# EasyEDA schematic Sheet_1.json
TITLE: Sheet_1; REV: 1.0; Date: 2023-08-03; Sheet: 1/1; Drawn By: calico-cat-3333; Company: Your Company
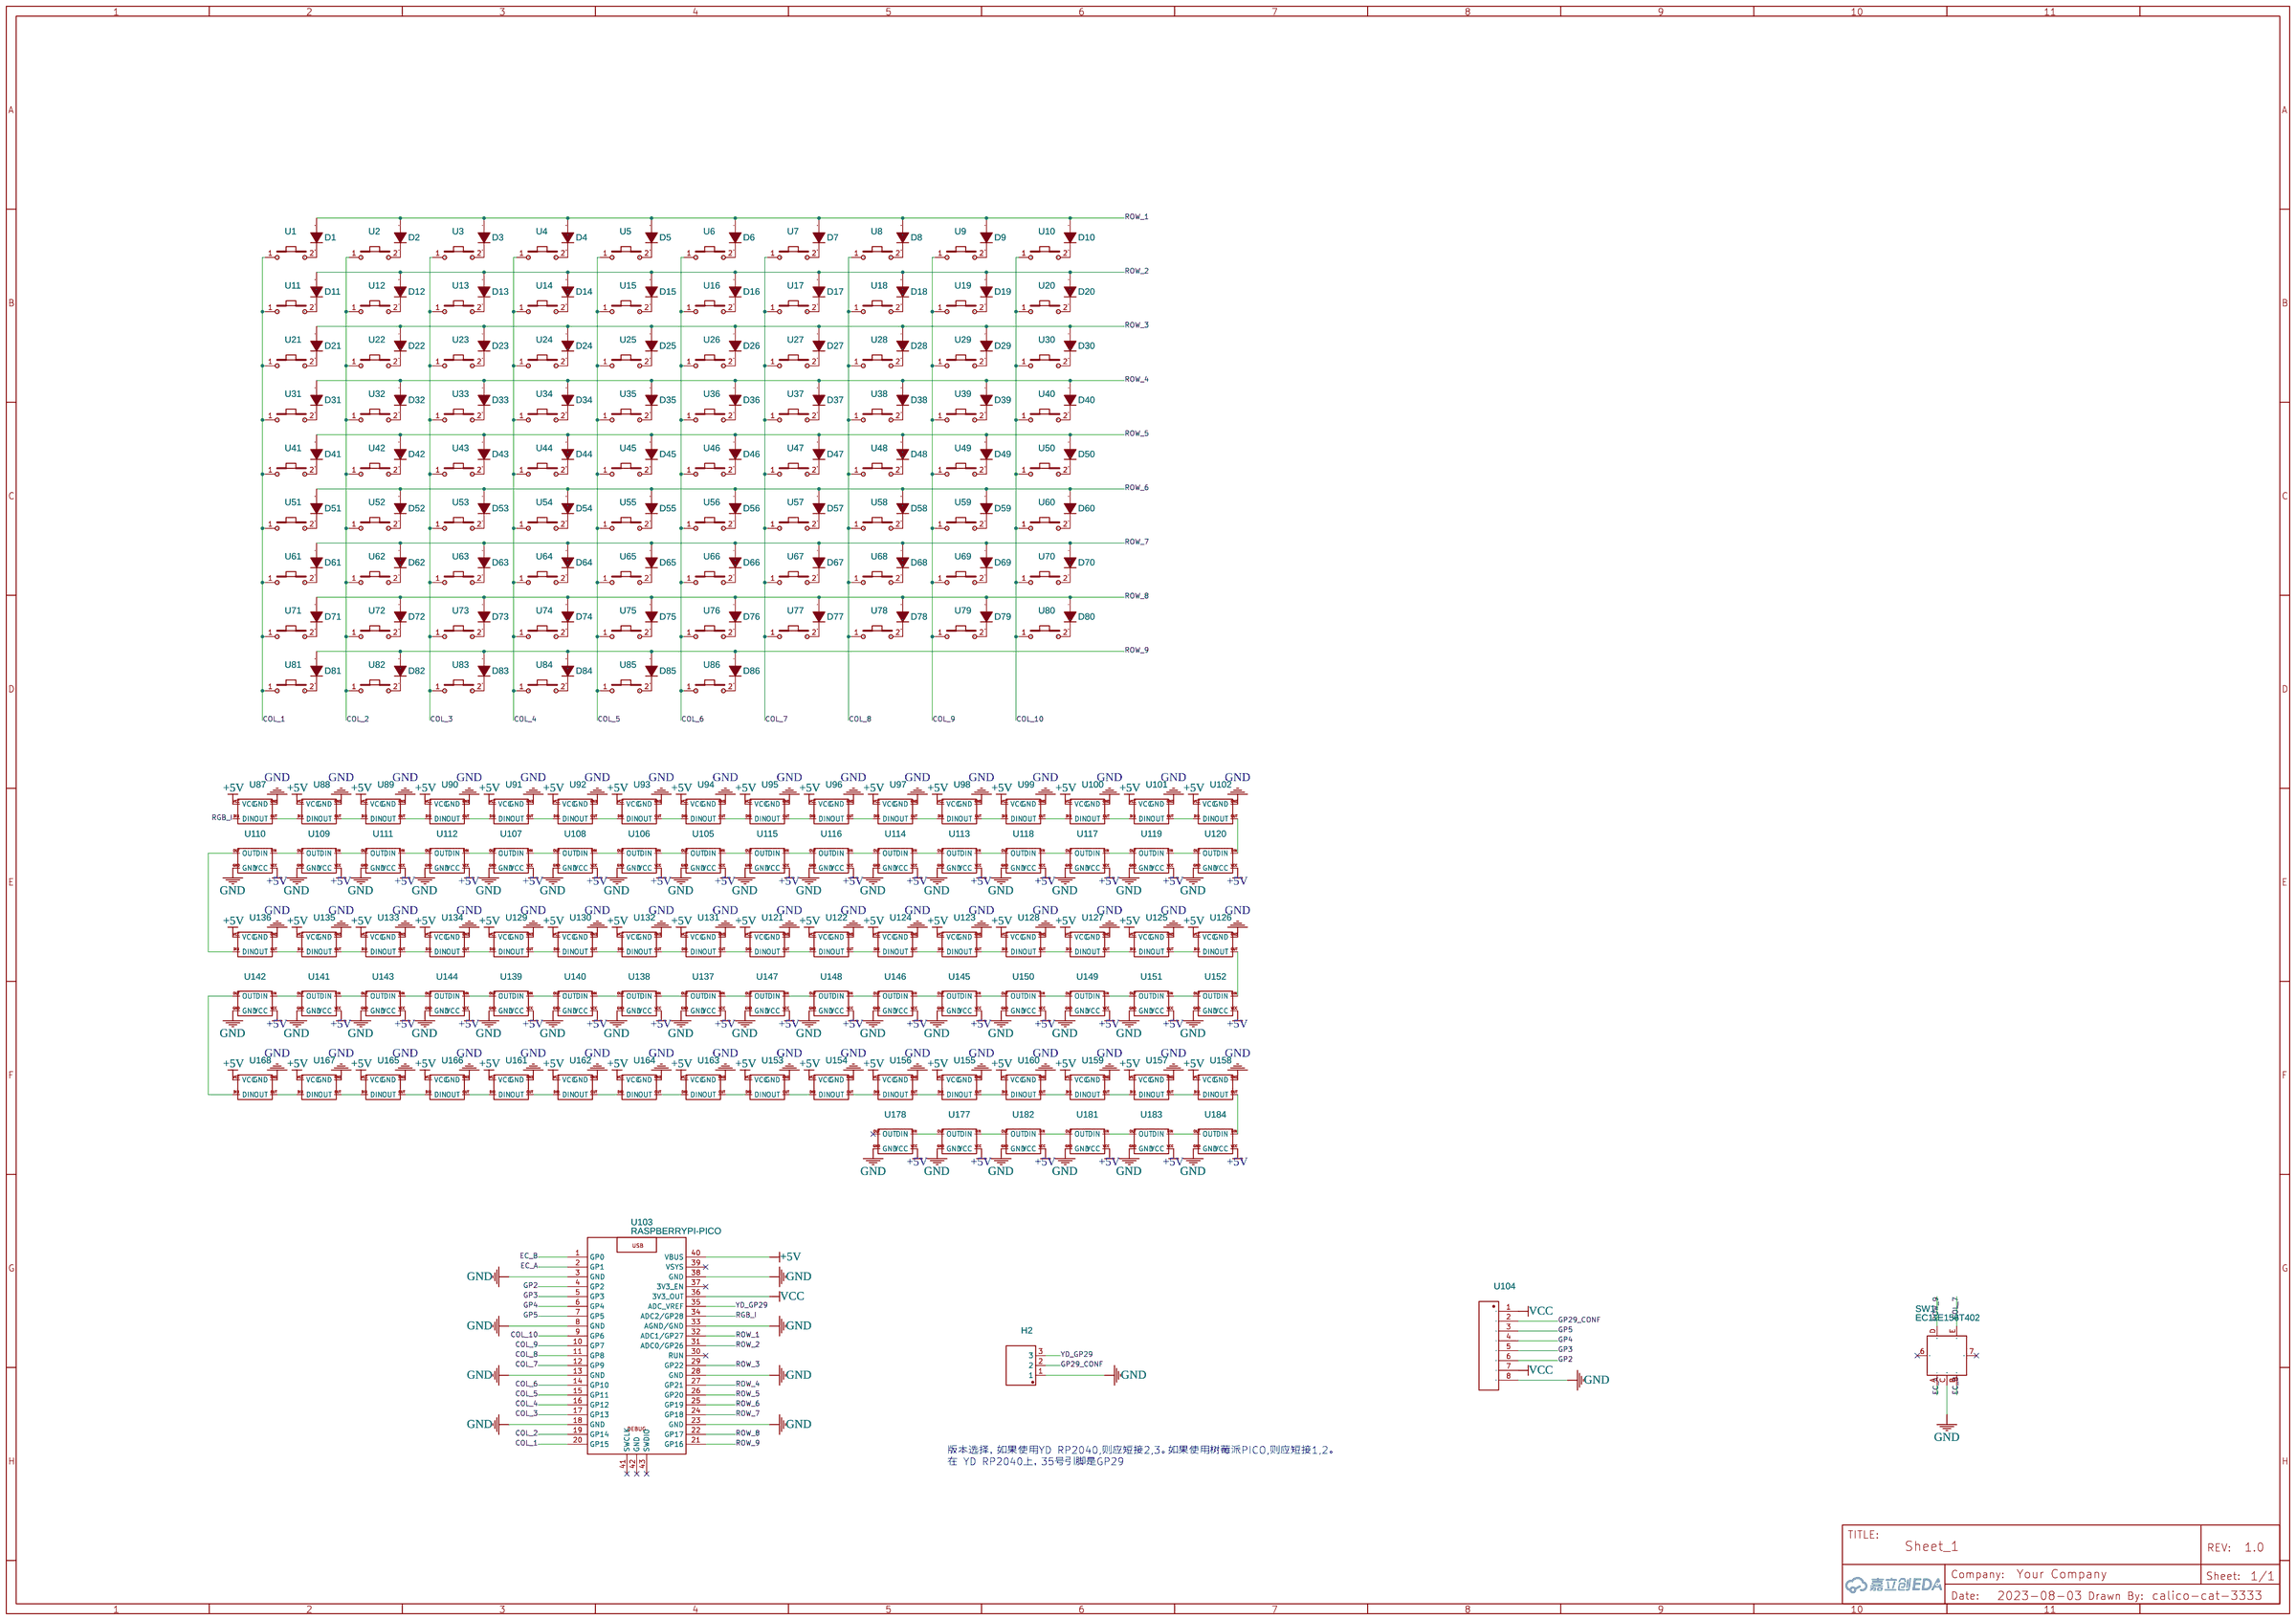
[diagram p0: schematic sheet]

## Parts
D1  TC1N4148T26B  [DO-35_BD2.0-L4.2-P8.20-D0.5-R-RD]
D2  TC1N4148T26B  [DO-35_BD2.0-L4.2-P8.20-D0.5-R-RD]
D3  TC1N4148T26B  [DO-35_BD2.0-L4.2-P8.20-D0.5-R-RD]
D4  TC1N4148T26B  [DO-35_BD2.0-L4.2-P8.20-D0.5-R-RD]
D5  TC1N4148T26B  [DO-35_BD2.0-L4.2-P8.20-D0.5-R-RD]
D6  TC1N4148T26B  [DO-35_BD2.0-L4.2-P8.20-D0.5-R-RD]
D7  TC1N4148T26B  [DO-35_BD2.0-L4.2-P8.20-D0.5-R-RD]
D8  TC1N4148T26B  [DO-35_BD2.0-L4.2-P8.20-D0.5-R-RD]
D9  TC1N4148T26B  [DO-35_BD2.0-L4.2-P8.20-D0.5-R-RD]
D10  TC1N4148T26B  [DO-35_BD2.0-L4.2-P8.20-D0.5-R-RD]
D11  TC1N4148T26B  [DO-35_BD2.0-L4.2-P8.20-D0.5-R-RD]
D12  TC1N4148T26B  [DO-35_BD2.0-L4.2-P8.20-D0.5-R-RD]
D13  TC1N4148T26B  [DO-35_BD2.0-L4.2-P8.20-D0.5-R-RD]
D14  TC1N4148T26B  [DO-35_BD2.0-L4.2-P8.20-D0.5-R-RD]
D15  TC1N4148T26B  [DO-35_BD2.0-L4.2-P8.20-D0.5-R-RD]
D16  TC1N4148T26B  [DO-35_BD2.0-L4.2-P8.20-D0.5-R-RD]
D17  TC1N4148T26B  [DO-35_BD2.0-L4.2-P8.20-D0.5-R-RD]
D18  TC1N4148T26B  [DO-35_BD2.0-L4.2-P8.20-D0.5-R-RD]
D19  TC1N4148T26B  [DO-35_BD2.0-L4.2-P8.20-D0.5-R-RD]
D20  TC1N4148T26B  [DO-35_BD2.0-L4.2-P8.20-D0.5-R-RD]
D21  TC1N4148T26B  [DO-35_BD2.0-L4.2-P8.20-D0.5-R-RD]
D22  TC1N4148T26B  [DO-35_BD2.0-L4.2-P8.20-D0.5-R-RD]
D23  TC1N4148T26B  [DO-35_BD2.0-L4.2-P8.20-D0.5-R-RD]
D24  TC1N4148T26B  [DO-35_BD2.0-L4.2-P8.20-D0.5-R-RD]
D25  TC1N4148T26B  [DO-35_BD2.0-L4.2-P8.20-D0.5-R-RD]
D26  TC1N4148T26B  [DO-35_BD2.0-L4.2-P8.20-D0.5-R-RD]
D27  TC1N4148T26B  [DO-35_BD2.0-L4.2-P8.20-D0.5-R-RD]
D28  TC1N4148T26B  [DO-35_BD2.0-L4.2-P8.20-D0.5-R-RD]
D29  TC1N4148T26B  [DO-35_BD2.0-L4.2-P8.20-D0.5-R-RD]
D30  TC1N4148T26B  [DO-35_BD2.0-L4.2-P8.20-D0.5-R-RD]
D31  TC1N4148T26B  [DO-35_BD2.0-L4.2-P8.20-D0.5-R-RD]
D32  TC1N4148T26B  [DO-35_BD2.0-L4.2-P8.20-D0.5-R-RD]
D33  TC1N4148T26B  [DO-35_BD2.0-L4.2-P8.20-D0.5-R-RD]
D34  TC1N4148T26B  [DO-35_BD2.0-L4.2-P8.20-D0.5-R-RD]
D35  TC1N4148T26B  [DO-35_BD2.0-L4.2-P8.20-D0.5-R-RD]
D36  TC1N4148T26B  [DO-35_BD2.0-L4.2-P8.20-D0.5-R-RD]
D37  TC1N4148T26B  [DO-35_BD2.0-L4.2-P8.20-D0.5-R-RD]
D38  TC1N4148T26B  [DO-35_BD2.0-L4.2-P8.20-D0.5-R-RD]
D39  TC1N4148T26B  [DO-35_BD2.0-L4.2-P8.20-D0.5-R-RD]
D40  TC1N4148T26B  [DO-35_BD2.0-L4.2-P8.20-D0.5-R-RD]
D41  TC1N4148T26B  [DO-35_BD2.0-L4.2-P8.20-D0.5-R-RD]
D42  TC1N4148T26B  [DO-35_BD2.0-L4.2-P8.20-D0.5-R-RD]
D43  TC1N4148T26B  [DO-35_BD2.0-L4.2-P8.20-D0.5-R-RD]
D44  TC1N4148T26B  [DO-35_BD2.0-L4.2-P8.20-D0.5-R-RD]
D45  TC1N4148T26B  [DO-35_BD2.0-L4.2-P8.20-D0.5-R-RD]
D46  TC1N4148T26B  [DO-35_BD2.0-L4.2-P8.20-D0.5-R-RD]
D47  TC1N4148T26B  [DO-35_BD2.0-L4.2-P8.20-D0.5-R-RD]
D48  TC1N4148T26B  [DO-35_BD2.0-L4.2-P8.20-D0.5-R-RD]
D49  TC1N4148T26B  [DO-35_BD2.0-L4.2-P8.20-D0.5-R-RD]
D50  TC1N4148T26B  [DO-35_BD2.0-L4.2-P8.20-D0.5-R-RD]
D51  TC1N4148T26B  [DO-35_BD2.0-L4.2-P8.20-D0.5-R-RD]
D52  TC1N4148T26B  [DO-35_BD2.0-L4.2-P8.20-D0.5-R-RD]
D53  TC1N4148T26B  [DO-35_BD2.0-L4.2-P8.20-D0.5-R-RD]
D54  TC1N4148T26B  [DO-35_BD2.0-L4.2-P8.20-D0.5-R-RD]
D55  TC1N4148T26B  [DO-35_BD2.0-L4.2-P8.20-D0.5-R-RD]
D56  TC1N4148T26B  [DO-35_BD2.0-L4.2-P8.20-D0.5-R-RD]
D57  TC1N4148T26B  [DO-35_BD2.0-L4.2-P8.20-D0.5-R-RD]
D58  TC1N4148T26B  [DO-35_BD2.0-L4.2-P8.20-D0.5-R-RD]
D59  TC1N4148T26B  [DO-35_BD2.0-L4.2-P8.20-D0.5-R-RD]
D60  TC1N4148T26B  [DO-35_BD2.0-L4.2-P8.20-D0.5-R-RD]
D61  TC1N4148T26B  [DO-35_BD2.0-L4.2-P8.20-D0.5-R-RD]
D62  TC1N4148T26B  [DO-35_BD2.0-L4.2-P8.20-D0.5-R-RD]
D63  TC1N4148T26B  [DO-35_BD2.0-L4.2-P8.20-D0.5-R-RD]
D64  TC1N4148T26B  [DO-35_BD2.0-L4.2-P8.20-D0.5-R-RD]
D65  TC1N4148T26B  [DO-35_BD2.0-L4.2-P8.20-D0.5-R-RD]
D66  TC1N4148T26B  [DO-35_BD2.0-L4.2-P8.20-D0.5-R-RD]
D67  TC1N4148T26B  [DO-35_BD2.0-L4.2-P8.20-D0.5-R-RD]
D68  TC1N4148T26B  [DO-35_BD2.0-L4.2-P8.20-D0.5-R-RD]
D69  TC1N4148T26B  [DO-35_BD2.0-L4.2-P8.20-D0.5-R-RD]
D70  TC1N4148T26B  [DO-35_BD2.0-L4.2-P8.20-D0.5-R-RD]
D71  TC1N4148T26B  [DO-35_BD2.0-L4.2-P8.20-D0.5-R-RD]
D72  TC1N4148T26B  [DO-35_BD2.0-L4.2-P8.20-D0.5-R-RD]
D73  TC1N4148T26B  [DO-35_BD2.0-L4.2-P8.20-D0.5-R-RD]
D74  TC1N4148T26B  [DO-35_BD2.0-L4.2-P8.20-D0.5-R-RD]
D75  TC1N4148T26B  [DO-35_BD2.0-L4.2-P8.20-D0.5-R-RD]
D76  TC1N4148T26B  [DO-35_BD2.0-L4.2-P8.20-D0.5-R-RD]
D77  TC1N4148T26B  [DO-35_BD2.0-L4.2-P8.20-D0.5-R-RD]
D78  TC1N4148T26B  [DO-35_BD2.0-L4.2-P8.20-D0.5-R-RD]
D79  TC1N4148T26B  [DO-35_BD2.0-L4.2-P8.20-D0.5-R-RD]
D80  TC1N4148T26B  [DO-35_BD2.0-L4.2-P8.20-D0.5-R-RD]
D81  TC1N4148T26B  [DO-35_BD2.0-L4.2-P8.20-D0.5-R-RD]
D82  TC1N4148T26B  [DO-35_BD2.0-L4.2-P8.20-D0.5-R-RD]
D83  TC1N4148T26B  [DO-35_BD2.0-L4.2-P8.20-D0.5-R-RD]
D84  TC1N4148T26B  [DO-35_BD2.0-L4.2-P8.20-D0.5-R-RD]
D85  TC1N4148T26B  [DO-35_BD2.0-L4.2-P8.20-D0.5-R-RD]
D86  TC1N4148T26B  [DO-35_BD2.0-L4.2-P8.20-D0.5-R-RD]
H2  210S-1*3P L=11.6MMGold-plated black  [HDR-TH_3P-P2.54-V-M-1]
SW1  EC11E156T402  [SW-TH_EC11E156T402]
U1  U90  [轴座]
U2  U90  [轴座]
U3  U90  [轴座]
U4  U90  [轴座]
U5  U90  [轴座]
U6  U90  [轴座]
U7  U90  [轴座]
U8  U90  [轴座]
U9  U90  [轴座]
U10  U90  [轴座]
U11  U90  [轴座]
U12  U90  [轴座]
U13  U90  [轴座]
U14  U90  [轴座]
U15  U90  [轴座]
U16  U90  [轴座]
U17  U90  [轴座]
U18  U90  [轴座]
U19  U90  [轴座]
U20  U90  [轴座]
U21  U90  [轴座]
U22  U90  [轴座]
U23  U90  [轴座]
U24  U90  [轴座]
U25  U90  [轴座]
U26  U90  [轴座]
U27  U90  [轴座]
U28  U90  [轴座]
U29  U90  [轴座]
U30  U90  [轴座]
U31  U90  [轴座]
U32  U90  [轴座]
U33  U90  [轴座]
U34  U90  [轴座]
U35  U90  [轴座]
U36  U90  [轴座]
U37  U90  [轴座]
U38  U90  [轴座]
U39  U90  [轴座]
U40  U90  [轴座]
U41  U90  [轴座]
U42  U90  [轴座]
U43  U90  [轴座]
U44  U90  [轴座]
U45  U90  [轴座]
U46  U90  [轴座]
U47  U90  [轴座]
U48  U90  [轴座]
U49  U90  [轴座]
U50  U90  [轴座]
U51  U90  [轴座]
U52  U90  [轴座]
U53  U90  [轴座]
U54  U90  [轴座]
U55  U90  [轴座]
U56  U90  [轴座]
U57  U90  [轴座]
U58  U90  [轴座]
U59  U90  [轴座]
U60  U90  [轴座]
U61  U90  [轴座]
U62  U90  [轴座]
U63  U90  [轴座]
U64  U90  [轴座]
U65  U90  [轴座]
U66  U90  [轴座]
U67  U90  [轴座]
U68  U90  [轴座]
U69  U90  [轴座]
U70  U90  [轴座]
U71  U90  [轴座]
U72  U90  [轴座]
U73  U90  [轴座]
U74  U90  [轴座]
U75  U90  [轴座]
U76  U90  [轴座]
U77  U90  [轴座]
U78  U90  [轴座]
U79  U90  [轴座]
U80  U90  [轴座]
U81  U90  [轴座]
U82  U90  [轴座]
U83  U90  [轴座]
U84  U90  [轴座]
U85  U90  [轴座]
U86  U90  [轴座]
U87  NO  [WS2812-3528-修正]
U88  NO  [WS2812-3528-修正]
U89  NO  [WS2812-3528-修正]
U90  NO  [WS2812-3528-修正]
U91  NO  [WS2812-3528-修正]
U92  NO  [WS2812-3528-修正]
U93  NO  [WS2812-3528-修正]
U94  NO  [WS2812-3528-修正]
U95  NO  [WS2812-3528-修正]
U96  NO  [WS2812-3528-修正]
U97  NO  [WS2812-3528-修正]
U98  NO  [WS2812-3528-修正]
U99  NO  [WS2812-3528-修正]
U100  NO  [WS2812-3528-修正]
U101  NO  [WS2812-3528-修正]
U102  NO  [WS2812-3528-修正]
U103  RASPBERRYPI-PICO  [RASPBERRYPI-PICO]
U104  U82  [排针 8P]
U105  NO  [WS2812-3528-修正]
U106  NO  [WS2812-3528-修正]
U107  NO  [WS2812-3528-修正]
U108  NO  [WS2812-3528-修正]
U109  NO  [WS2812-3528-修正]
U110  NO  [WS2812-3528-修正]
U111  NO  [WS2812-3528-修正]
U112  NO  [WS2812-3528-修正]
U113  NO  [WS2812-3528-修正]
U114  NO  [WS2812-3528-修正]
U115  NO  [WS2812-3528-修正]
U116  NO  [WS2812-3528-修正]
U117  NO  [WS2812-3528-修正]
U118  NO  [WS2812-3528-修正]
U119  NO  [WS2812-3528-修正]
U120  NO  [WS2812-3528-修正]
U121  NO  [WS2812-3528-修正]
U122  NO  [WS2812-3528-修正]
U123  NO  [WS2812-3528-修正]
U124  NO  [WS2812-3528-修正]
U125  NO  [WS2812-3528-修正]
U126  NO  [WS2812-3528-修正]
U127  NO  [WS2812-3528-修正]
U128  NO  [WS2812-3528-修正]
U129  NO  [WS2812-3528-修正]
U130  NO  [WS2812-3528-修正]
U131  NO  [WS2812-3528-修正]
U132  NO  [WS2812-3528-修正]
U133  NO  [WS2812-3528-修正]
U134  NO  [WS2812-3528-修正]
U135  NO  [WS2812-3528-修正]
U136  NO  [WS2812-3528-修正]
U137  NO  [WS2812-3528-修正]
U138  NO  [WS2812-3528-修正]
U139  NO  [WS2812-3528-修正]
U140  NO  [WS2812-3528-修正]
U141  NO  [WS2812-3528-修正]
U142  NO  [WS2812-3528-修正]
U143  NO  [WS2812-3528-修正]
U144  NO  [WS2812-3528-修正]
U145  NO  [WS2812-3528-修正]
U146  NO  [WS2812-3528-修正]
U147  NO  [WS2812-3528-修正]
U148  NO  [WS2812-3528-修正]
U149  NO  [WS2812-3528-修正]
U150  NO  [WS2812-3528-修正]
U151  NO  [WS2812-3528-修正]
U152  NO  [WS2812-3528-修正]
U153  NO  [WS2812-3528-修正]
U154  NO  [WS2812-3528-修正]
U155  NO  [WS2812-3528-修正]
U156  NO  [WS2812-3528-修正]
U157  NO  [WS2812-3528-修正]
U158  NO  [WS2812-3528-修正]
U159  NO  [WS2812-3528-修正]
U160  NO  [WS2812-3528-修正]
U161  NO  [WS2812-3528-修正]
U162  NO  [WS2812-3528-修正]
U163  NO  [WS2812-3528-修正]
U164  NO  [WS2812-3528-修正]
U165  NO  [WS2812-3528-修正]
U166  NO  [WS2812-3528-修正]
U167  NO  [WS2812-3528-修正]
U168  NO  [WS2812-3528-修正]
U177  NO  [WS2812-3528-修正]
U178  NO  [WS2812-3528-修正]
U181  NO  [WS2812-3528-修正]
U182  NO  [WS2812-3528-修正]
U183  NO  [WS2812-3528-修正]
U184  NO  [WS2812-3528-修正]

## Library data of the parts
D1-D86 = TC1N4148T26B: Contributor: LCSC; Supplier: LCSC; Supplier Part: C261224; Manufacturer: TC(德昌); JLCPCB Part Class: Extended Part; link: https://so.szlcsc.com/global.html?k=C261224&ref=editor
H2 = 210S-1*3P L=11.6MMGold-plated black: Contributor: LCSC; Supplier: LCSC; Manufacturer: Ckmtw(灿科盟); Manufacturer Part: B-2100S03P-A110; Supplier Part: C124376; JLCPCB Part Class: Extended Part; link: https://so.szlcsc.com/global.html?k=C124376&ref=editor
SW1 = EC11E156T402: Contributor: LCSC; Supplier: LCSC; Supplier Part: C2687292; Manufacturer: ALPSALPINE(阿尔卑斯阿尔派); JLCPCB Part Class: Extended Part; link: https://so.szlcsc.com/global.html?k=C2687292&ref=editor
U1-U86 = 轴座: Contributor: fengmoyiye
U87-U102 U105-U168 U177 U178 U181-U184 = WS2812-3528: Contributor: Jimssa
U103 = RASPBERRYPI-PICO: link: https://datasheets.raspberrypi.org/pico/pico-product-brief.pdf; Contributor: zhangwenyi
U104 = 排针 8P: Contributor: wxwt; Package Display: No

## Nets
+5V: U87.VCC U88.VCC U89.VCC U90.VCC U91.VCC U92.VCC U93.VCC U94.VCC U95.VCC U96.VCC U97.VCC U98.VCC U99.VCC U100.VCC U101.VCC U102.VCC U103.40(VBUS) U105.VCC U106.VCC U107.VCC U108.VCC U109.VCC U110.VCC U111.VCC U112.VCC U113.VCC U114.VCC U115.VCC U116.VCC U117.VCC U118.VCC U119.VCC U120.VCC U121.VCC U122.VCC U123.VCC U124.VCC U125.VCC U126.VCC U127.VCC U128.VCC U129.VCC U130.VCC U131.VCC U132.VCC U133.VCC U134.VCC U135.VCC U136.VCC U137.VCC U138.VCC U139.VCC U140.VCC U141.VCC U142.VCC U143.VCC U144.VCC U145.VCC U146.VCC U147.VCC U148.VCC U149.VCC U150.VCC U151.VCC U152.VCC U153.VCC U154.VCC U155.VCC U156.VCC U157.VCC U158.VCC U159.VCC U160.VCC U161.VCC U162.VCC U163.VCC U164.VCC U165.VCC U166.VCC U167.VCC U168.VCC U177.VCC U178.VCC U181.VCC U182.VCC U183.VCC U184.VCC
GND: H2.1 SW1.C U87.GND U88.GND U89.GND U90.GND U91.GND U92.GND U93.GND U94.GND U95.GND U96.GND U97.GND U98.GND U99.GND U100.GND U101.GND U102.GND U103.3(GND) U103.8(GND) U103.13(GND) U103.18(GND) U103.23(GND) U103.28(GND) U103.33(AGND/GND) U103.38(GND) U104.8 U105.GND U106.GND U107.GND U108.GND U109.GND U110.GND U111.GND U112.GND U113.GND U114.GND U115.GND U116.GND U117.GND U118.GND U119.GND U120.GND U121.GND U122.GND U123.GND U124.GND U125.GND U126.GND U127.GND U128.GND U129.GND U130.GND U131.GND U132.GND U133.GND U134.GND U135.GND U136.GND U137.GND U138.GND U139.GND U140.GND U141.GND U142.GND U143.GND U144.GND U145.GND U146.GND U147.GND U148.GND U149.GND U150.GND U151.GND U152.GND U153.GND U154.GND U155.GND U156.GND U157.GND U158.GND U159.GND U160.GND U161.GND U162.GND U163.GND U164.GND U165.GND U166.GND U167.GND U168.GND U177.GND U178.GND U181.GND U182.GND U183.GND U184.GND
VCC: U103.36(3V3_OUT) U104.1 U104.7
COL_1: U1.1 U11.1 U21.1 U31.1 U41.1 U51.1 U61.1 U71.1 U81.1 U103.20(GP15)
COL_2: U2.1 U12.1 U22.1 U32.1 U42.1 U52.1 U62.1 U72.1 U82.1 U103.19(GP14)
COL_3: U3.1 U13.1 U23.1 U33.1 U43.1 U53.1 U63.1 U73.1 U83.1 U103.17(GP13)
COL_4: U4.1 U14.1 U24.1 U34.1 U44.1 U54.1 U64.1 U74.1 U84.1 U103.16(GP12)
COL_5: U5.1 U15.1 U25.1 U35.1 U45.1 U55.1 U65.1 U75.1 U85.1 U103.15(GP11)
COL_6: U6.1 U16.1 U26.1 U36.1 U46.1 U56.1 U66.1 U76.1 U86.1 U103.14(GP10)
COL_7: SW1.E U7.1 U17.1 U27.1 U37.1 U47.1 U57.1 U67.1 U77.1 U103.12(GP9)
COL_8: U8.1 U18.1 U28.1 U38.1 U48.1 U58.1 U68.1 U78.1 U103.11(GP8)
COL_9: U9.1 U19.1 U29.1 U39.1 U49.1 U59.1 U69.1 U79.1 U103.10(GP7)
COL_10: U10.1 U20.1 U30.1 U40.1 U50.1 U60.1 U70.1 U80.1 U103.9(GP6)
EC_A: SW1.A U103.2(GP1)
EC_B: SW1.B U103.1(GP0)
GP2: U103.4(GP2) U104.6
GP3: U103.5(GP3) U104.5
GP4: U103.6(GP4) U104.4
GP5: U103.7(GP5) U104.3
GP29_CONF: H2.2 U104.2
RGB_I: U87.DIN U103.34(ADC2/GP28)
ROW_1: D1.1(A) D2.1(A) D3.1(A) D4.1(A) D5.1(A) D6.1(A) D7.1(A) D8.1(A) D9.1(A) D10.1(A) U103.32(ADC1/GP27)
ROW_2: D11.1(A) D12.1(A) D13.1(A) D14.1(A) D15.1(A) D16.1(A) D17.1(A) D18.1(A) D19.1(A) D20.1(A) U103.31(ADC0/GP26)
ROW_3: D21.1(A) D22.1(A) D23.1(A) D24.1(A) D25.1(A) D26.1(A) D27.1(A) D28.1(A) D29.1(A) D30.1(A) U103.29(GP22)
ROW_4: D31.1(A) D32.1(A) D33.1(A) D34.1(A) D35.1(A) D36.1(A) D37.1(A) D38.1(A) D39.1(A) D40.1(A) U103.27(GP21)
ROW_5: D41.1(A) D42.1(A) D43.1(A) D44.1(A) D45.1(A) D46.1(A) D47.1(A) D48.1(A) D49.1(A) D50.1(A) U103.26(GP20)
ROW_6: D51.1(A) D52.1(A) D53.1(A) D54.1(A) D55.1(A) D56.1(A) D57.1(A) D58.1(A) D59.1(A) D60.1(A) U103.25(GP19)
ROW_7: D61.1(A) D62.1(A) D63.1(A) D64.1(A) D65.1(A) D66.1(A) D67.1(A) D68.1(A) D69.1(A) D70.1(A) U103.24(GP18)
ROW_8: D71.1(A) D72.1(A) D73.1(A) D74.1(A) D75.1(A) D76.1(A) D77.1(A) D78.1(A) D79.1(A) D80.1(A) U103.22(GP17)
ROW_9: D81.1(A) D82.1(A) D83.1(A) D84.1(A) D85.1(A) D86.1(A) SW1.D U103.21(GP16)
YD_GP29: H2.3 U103.35(ADC_VREF)
Net-(D1-2): D1.2(K) U1.2
Net-(D2-2): D2.2(K) U2.2
Net-(D3-2): D3.2(K) U3.2
Net-(D4-2): D4.2(K) U4.2
Net-(D5-2): D5.2(K) U5.2
Net-(D6-2): D6.2(K) U6.2
Net-(D7-2): D7.2(K) U7.2
Net-(D8-2): D8.2(K) U8.2
Net-(D9-2): D9.2(K) U9.2
Net-(D10-2): D10.2(K) U10.2
Net-(D11-2): D11.2(K) U11.2
Net-(D12-2): D12.2(K) U12.2
Net-(D13-2): D13.2(K) U13.2
Net-(D14-2): D14.2(K) U14.2
Net-(D15-2): D15.2(K) U15.2
Net-(D16-2): D16.2(K) U16.2
Net-(D17-2): D17.2(K) U17.2
Net-(D18-2): D18.2(K) U18.2
Net-(D19-2): D19.2(K) U19.2
Net-(D20-2): D20.2(K) U20.2
Net-(D21-2): D21.2(K) U21.2
Net-(D22-2): D22.2(K) U22.2
Net-(D23-2): D23.2(K) U23.2
Net-(D24-2): D24.2(K) U24.2
Net-(D25-2): D25.2(K) U25.2
Net-(D26-2): D26.2(K) U26.2
Net-(D27-2): D27.2(K) U27.2
Net-(D28-2): D28.2(K) U28.2
Net-(D29-2): D29.2(K) U29.2
Net-(D30-2): D30.2(K) U30.2
Net-(D31-2): D31.2(K) U31.2
Net-(D32-2): D32.2(K) U32.2
Net-(D33-2): D33.2(K) U33.2
Net-(D34-2): D34.2(K) U34.2
Net-(D35-2): D35.2(K) U35.2
Net-(D36-2): D36.2(K) U36.2
Net-(D37-2): D37.2(K) U37.2
Net-(D38-2): D38.2(K) U38.2
Net-(D39-2): D39.2(K) U39.2
Net-(D40-2): D40.2(K) U40.2
Net-(D41-2): D41.2(K) U41.2
Net-(D42-2): D42.2(K) U42.2
Net-(D43-2): D43.2(K) U43.2
Net-(D44-2): D44.2(K) U44.2
Net-(D45-2): D45.2(K) U45.2
Net-(D46-2): D46.2(K) U46.2
Net-(D47-2): D47.2(K) U47.2
Net-(D48-2): D48.2(K) U48.2
Net-(D49-2): D49.2(K) U49.2
Net-(D50-2): D50.2(K) U50.2
Net-(D51-2): D51.2(K) U51.2
Net-(D52-2): D52.2(K) U52.2
Net-(D53-2): D53.2(K) U53.2
Net-(D54-2): D54.2(K) U54.2
Net-(D55-2): D55.2(K) U55.2
Net-(D56-2): D56.2(K) U56.2
Net-(D57-2): D57.2(K) U57.2
Net-(D58-2): D58.2(K) U58.2
Net-(D59-2): D59.2(K) U59.2
Net-(D60-2): D60.2(K) U60.2
Net-(D61-2): D61.2(K) U61.2
Net-(D62-2): D62.2(K) U62.2
Net-(D63-2): D63.2(K) U63.2
Net-(D64-2): D64.2(K) U64.2
Net-(D65-2): D65.2(K) U65.2
Net-(D66-2): D66.2(K) U66.2
Net-(D67-2): D67.2(K) U67.2
Net-(D68-2): D68.2(K) U68.2
Net-(D69-2): D69.2(K) U69.2
Net-(D70-2): D70.2(K) U70.2
Net-(D71-2): D71.2(K) U71.2
Net-(D72-2): D72.2(K) U72.2
Net-(D73-2): D73.2(K) U73.2
Net-(D74-2): D74.2(K) U74.2
Net-(D75-2): D75.2(K) U75.2
Net-(D76-2): D76.2(K) U76.2
Net-(D77-2): D77.2(K) U77.2
Net-(D78-2): D78.2(K) U78.2
Net-(D79-2): D79.2(K) U79.2
Net-(D80-2): D80.2(K) U80.2
Net-(D81-2): D81.2(K) U81.2
Net-(D82-2): D82.2(K) U82.2
Net-(D83-2): D83.2(K) U83.2
Net-(D84-2): D84.2(K) U84.2
Net-(D85-2): D85.2(K) U85.2
Net-(D86-2): D86.2(K) U86.2
Net-(U87-OUT): U87.OUT U88.DIN
Net-(U88-OUT): U88.OUT U89.DIN
Net-(U89-OUT): U89.OUT U90.DIN
Net-(U90-OUT): U90.OUT U91.DIN
Net-(U91-OUT): U91.OUT U92.DIN
Net-(U92-OUT): U92.OUT U93.DIN
Net-(U93-OUT): U93.OUT U94.DIN
Net-(U94-OUT): U94.OUT U95.DIN
Net-(U95-OUT): U95.OUT U96.DIN
Net-(U96-OUT): U96.OUT U97.DIN
Net-(U97-OUT): U97.OUT U98.DIN
Net-(U98-OUT): U98.OUT U99.DIN
Net-(U99-OUT): U99.OUT U100.DIN
Net-(U100-OUT): U100.OUT U101.DIN
Net-(U101-OUT): U101.OUT U102.DIN
Net-(U102-OUT): U102.OUT U120.DIN
Net-(U105-DIN): U105.DIN U115.OUT
Net-(U105-OUT): U105.OUT U106.DIN
Net-(U106-OUT): U106.OUT U108.DIN
Net-(U107-DIN): U107.DIN U108.OUT
Net-(U107-OUT): U107.OUT U112.DIN
Net-(U109-DIN): U109.DIN U111.OUT
Net-(U109-OUT): U109.OUT U110.DIN
Net-(U110-OUT): U110.OUT U136.DIN
Net-(U111-DIN): U111.DIN U112.OUT
Net-(U113-DIN): U113.DIN U118.OUT
Net-(U113-OUT): U113.OUT U114.DIN
Net-(U114-OUT): U114.OUT U116.DIN
Net-(U115-DIN): U115.DIN U116.OUT
Net-(U117-DIN): U117.DIN U119.OUT
Net-(U117-OUT): U117.OUT U118.DIN
Net-(U119-DIN): U119.DIN U120.OUT
Net-(U121-DIN): U121.DIN U131.OUT
Net-(U121-OUT): U121.OUT U122.DIN
Net-(U122-OUT): U122.OUT U124.DIN
Net-(U123-DIN): U123.DIN U124.OUT
Net-(U123-OUT): U123.OUT U128.DIN
Net-(U125-DIN): U125.DIN U127.OUT
Net-(U125-OUT): U125.OUT U126.DIN
Net-(U126-OUT): U126.OUT U152.DIN
Net-(U127-DIN): U127.DIN U128.OUT
Net-(U129-DIN): U129.DIN U134.OUT
Net-(U129-OUT): U129.OUT U130.DIN
Net-(U130-OUT): U130.OUT U132.DIN
Net-(U131-DIN): U131.DIN U132.OUT
Net-(U133-DIN): U133.DIN U135.OUT
Net-(U133-OUT): U133.OUT U134.DIN
Net-(U135-DIN): U135.DIN U136.OUT
Net-(U137-DIN): U137.DIN U147.OUT
Net-(U137-OUT): U137.OUT U138.DIN
Net-(U138-OUT): U138.OUT U140.DIN
Net-(U139-DIN): U139.DIN U140.OUT
Net-(U139-OUT): U139.OUT U144.DIN
Net-(U141-DIN): U141.DIN U143.OUT
Net-(U141-OUT): U141.OUT U142.DIN
Net-(U142-OUT): U142.OUT U168.DIN
Net-(U143-DIN): U143.DIN U144.OUT
Net-(U145-DIN): U145.DIN U150.OUT
Net-(U145-OUT): U145.OUT U146.DIN
Net-(U146-OUT): U146.OUT U148.DIN
Net-(U147-DIN): U147.DIN U148.OUT
Net-(U149-DIN): U149.DIN U151.OUT
Net-(U149-OUT): U149.OUT U150.DIN
Net-(U151-DIN): U151.DIN U152.OUT
Net-(U153-DIN): U153.DIN U163.OUT
Net-(U153-OUT): U153.OUT U154.DIN
Net-(U154-OUT): U154.OUT U156.DIN
Net-(U155-DIN): U155.DIN U156.OUT
Net-(U155-OUT): U155.OUT U160.DIN
Net-(U157-DIN): U157.DIN U159.OUT
Net-(U157-OUT): U157.OUT U158.DIN
Net-(U158-OUT): U158.OUT U184.DIN
Net-(U159-DIN): U159.DIN U160.OUT
Net-(U161-DIN): U161.DIN U166.OUT
Net-(U161-OUT): U161.OUT U162.DIN
Net-(U162-OUT): U162.OUT U164.DIN
Net-(U163-DIN): U163.DIN U164.OUT
Net-(U165-DIN): U165.DIN U167.OUT
Net-(U165-OUT): U165.OUT U166.DIN
Net-(U167-DIN): U167.DIN U168.OUT
Net-(U177-DIN): U177.DIN U182.OUT
Net-(U177-OUT): U177.OUT U178.DIN
Net-(U181-DIN): U181.DIN U183.OUT
Net-(U181-OUT): U181.OUT U182.DIN
Net-(U183-DIN): U183.DIN U184.OUT

Not connected (* = marked no-connect by the designer): SW1 6(EH)* 7(EH)*; U103 30(RUN)* 37(3V3_EN)* 39(VSYS)* 41(SWCLK)* 42(GND)* 43(SWDIO)*; U178 OUT*

## Notes on the sheet
- 版本选择，如果使用YD RP2040,则应短接2,3。如果使用树莓派PICO,则应短接1,2。
  在 YD RP2040上，35号引脚是GP29
